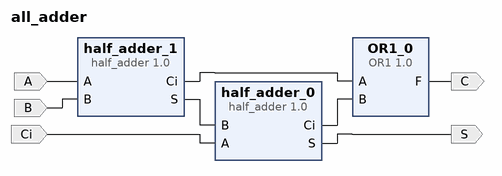
[diagram p0: block diagram of the top level]
# Vivado block design all_adder, xc7a35tcsg324-1, Vivado 2017.1
create_bd_design all_adder

create_bd_port -dir I Ci
create_bd_port -dir I A
create_bd_port -dir I B
create_bd_port -dir O S
create_bd_port -dir O C

create_bd_cell -type ip -vlnv xilinx.com:user:half_adder:1.0 half_adder_0
create_bd_cell -type ip -vlnv xilinx.com:user:half_adder:1.0 half_adder_1
create_bd_cell -type ip -vlnv xilinx.com:user:OR1:1.0 OR1_0

# ---- connections ----

connect_bd_net [get_bd_pins half_adder_1/S] [get_bd_pins half_adder_0/B]
connect_bd_net [get_bd_ports Ci] [get_bd_pins half_adder_0/A]
connect_bd_net [get_bd_ports A] [get_bd_pins half_adder_1/A]
connect_bd_net [get_bd_ports B] [get_bd_pins half_adder_1/B]
connect_bd_net [get_bd_pins half_adder_0/S] [get_bd_ports S]
connect_bd_net [get_bd_pins half_adder_1/Ci] [get_bd_pins OR1_0/A]
connect_bd_net [get_bd_pins half_adder_0/Ci] [get_bd_pins OR1_0/B]
connect_bd_net [get_bd_pins OR1_0/F] [get_bd_ports C]

validate_bd_design
save_bd_design
